# Altium schematic sheet Secondary protection.SchDoc
size A4; SheetNumber: 5; SheetTotal: 5
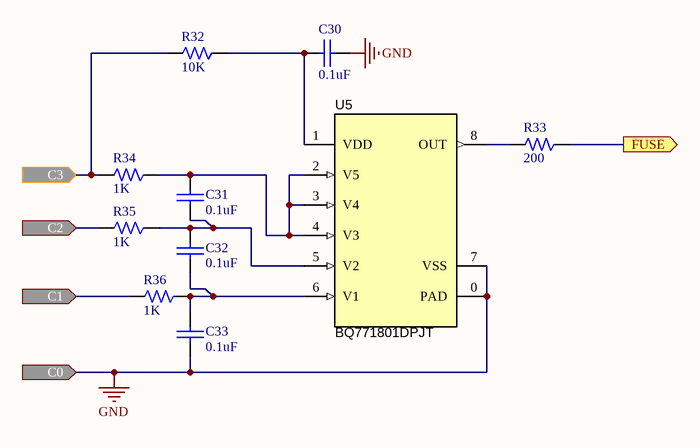
[diagram p0: Secondary protection.SchDoc]

## Parts
C30  value 0.1uF  [CAPC0603-RW]  (hidden comment: T542021037308)
C31  value 0.1uF  [CAPC0603-RW]  (hidden comment: T542021037308)
C32  value 0.1uF  [CAPC0603-RW]  (hidden comment: T542021037308)
C33  value 0.1uF  [CAPC0603-RW]  (hidden comment: T542021037308)
R32  value 10K  [0603-RW]  (hidden comment: T502976002399)
R33  value 200  [0603-RW]  (hidden comment: T502976002399)
R34  value 1K  [0603-RW]  (hidden comment: T502976002399)
R35  value 1K  [0603-RW]  (hidden comment: T502976002399)
R36  value 1K  [0603-RW]  (hidden comment: T502976002399)
U5  BQ771801DPJT  [WSON(6x5x0.8)]

## Ports
C0 (in), C1 (in), C2 (in), C3 (in), FUSE (out)

## Nets
GND: C30.2 C33.2 U5.0(PAD) U5.7(VSS) ; port C0
C1: R36.2 ; port C1
C2: R35.2 ; port C2
C3: R32.2 R34.2 ; port C3
FUSE: R33.1 ; port FUSE
NetC30_1: C30.1 R32.1 U5.1(VDD)
NetC31_1: C31.1 R34.1 U5.2(V5) U5.3(V4) U5.4(V3)
NetC31_2: C31.2 C32.1 R35.1 U5.5(V2)
NetC32_2: C32.2 C33.1 R36.1 U5.6(V1)
NetR33_2: R33.2 U5.8(OUT)

## Notes on the sheet
- Author
- Title
- Size:
- Date:
- A4
- Number:
- Time:
- Revision:
- Sheet
- of
- Radio Flyer inc
- West Chicago
- File:

## Library data of the parts
C30-C33 = CAP0603 0.01uF 16V 10%_X7R_WALSIN: CAP X7R .01UF 16V +-10% 0603 WALSIN L; Tolerance: 10%; Type: Capacitor; CREATE_NAME: Nathan; DIP&SMD: SMD; SAP: T542021037308; PACKAGE: CAPC0603; Vendor Name: *; MFG: WALSIN; MFG Part: *; Other: X7R; CREATE_TIME: 13-July-2016; Customer Specific: N/A; Voltage: 16V
R32-R36 = RES0603 1/10W +-1% 976 OHM 100PPM: CHIP 976 OHM 100PPM +-1% 0603 WALS L; Power: 0.1W; MFG: WALSIN; CREATE_NAME: Tom; DIP&SMD: SMD; Vendor Code: *; SAP: T502976002399; Vendor Name: *; MFG Part: *; Type: Resistor; CREATE_TIME: 17-Dec-2015; PACKAGE: 0603; TOL: +-1%; Customer Specific: N/A
U5 = CMP-0078897-2: Family 2-5S Overvoltage Protector with Internal Delay Timer, DPJ0008A (WSON-8); Alternate PartNumber: BQ771801DPJR; Alternate Manufacturer: Texas Instruments; SizeAreaWB_mm2: 20; SizeZ_mm: 0.8; SizeX_mm: 4; SizeY_mm: 3; SizeArea_mm2: 12; CompType: IC; AEC Qualified: N; AEC Category: Q200; ComponentLink1URL: http://www.ti.com/lit/ds/symlink/bq7718.pdf; PackageDescription: WSON-8; RoHS: Y; MountType: SMT; ComponentLink2URL: http://www.ti.com/product/bq7718; ComponentLink2Description: Product Folder; Manufacturer: Texas Instruments; PackageReference: DPJ0008A; PartNumber: BQ771801DPJT; ComponentLink1Description: Datasheet Link